# EAGLE design UWBFlat_v01 (EAGLE 9.6.1)

## Sheet 1 of 4
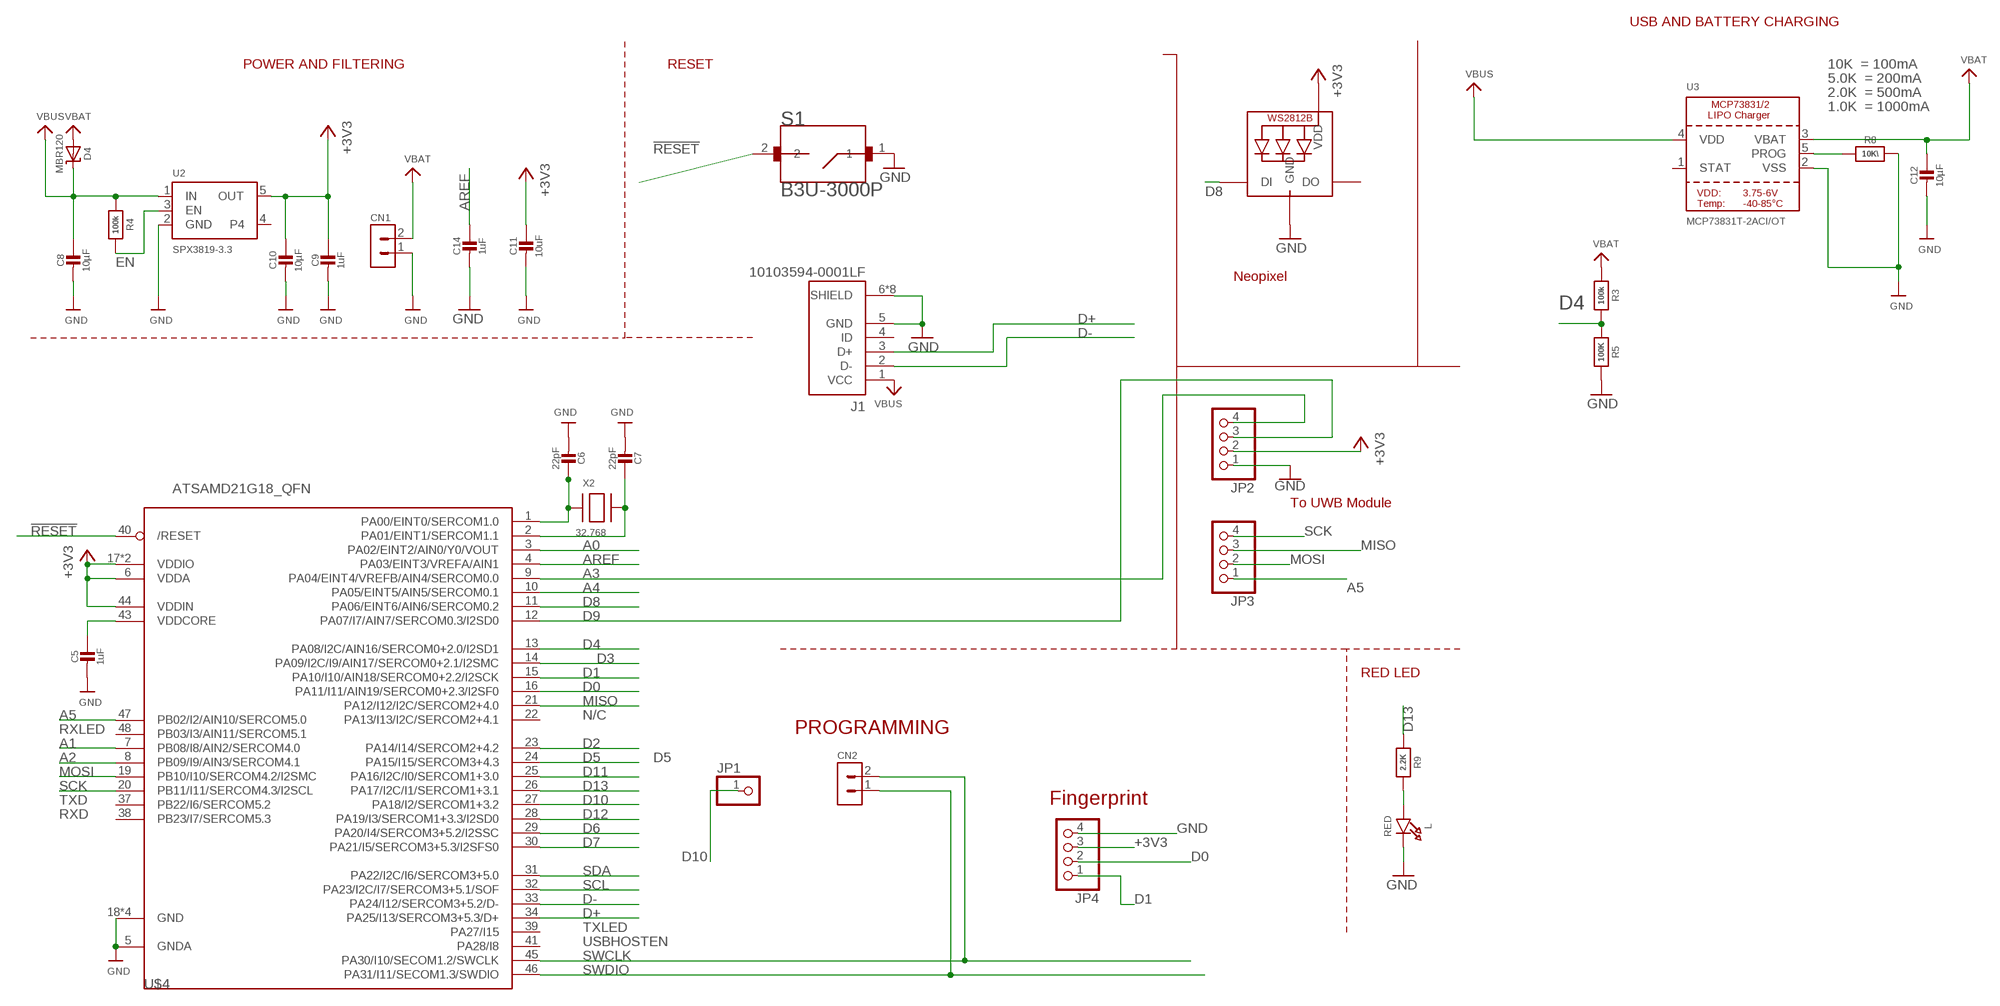
[diagram p0: schematic, sheet 1]

### Parts
C5  1uF  CAP_CERAMIC0603_NO  [0603-NO]
C6  22pF  CAP_CERAMIC0603_NO  [0603-NO]
C7  22pF  CAP_CERAMIC0603_NO  [0603-NO]
C8  10µF  CAP_CERAMIC0805-NOOUTLINE  [0805-NO]
C9  1uF  CAP_CERAMIC0603_NO  [0603-NO]
C10  10µF  CAP_CERAMIC0805-NOOUTLINE  [0805-NO]
C11  10uF  CAP_CERAMIC0805-NOOUTLINE  [0805-NO]
C12  10µF  CAP_CERAMIC0805-NOOUTLINE  [0805-NO]
C14  1uF  CAP_CERAMIC0603_NO  [0603-NO]
CN1  HEADER_1X02  [HEADER_1X02]
CN2  HEADER_1X02  [HEADER_1X02]
D4  MBR120  DIODE-SCHOTTKYSOD-123  [SOD-123]
J1  10103594-0001LF  [AMPHENOL_10103594-0001LF]
JP1  PINHD-1X1CB  [1X01-CLEANBIG]
JP2  HEADER-1X4ROUND  [1X04_ROUND]
JP3  HEADER-1X4ROUND  [1X04_ROUND]
JP4  HEADER-1X4ROUND  [1X04_ROUND]
L  RED  LED0805_NOOUTLINE  [CHIPLED_0805_NOOUTLINE]
LED1  WS2812B3535  [LED3535]
R3  100k  RESISTOR_0603_NOOUT  [0603-NO]
R4  100k  RESISTOR_0603_NOOUT  [0603-NO]
R5  100K  RESISTOR_0603_NOOUT  [0603-NO]
R8  10K\  RESISTOR_0603_NOOUT  [0603-NO]
R9  2.2K  RESISTOR_0603_NOOUT  [0603-NO]
S1  B3U-3000P  [SW_B3U-3000P]
U2  SPX3819-3.3  VREG_SOT23-5  [SOT23-5]
U3  MCP73831T-2ACI/OT  MCP73831/2  [SOT23-5]
U$4  ATSAMD21G18_QFN  ATSAMD21J_QFN  [TQFN48_7MM]
X2  32.768  XTAL-3.2X1.5  [XTAL3215]

### Nets
!RESET: S1.2 U$4.40(/RESET)
+3V3: C9.1 C10.1 C11.1 JP2.2 JP4.3 LED1.2(VDD) U2.5(OUT) U$4.6(VDDA) U$4.17(VDDIO) U$4.36(VDDIO) U$4.44(VDDIN) ; also sheet 2,3,4
A0: U$4.3(PA02/EINT2/AIN0/Y0/VOUT)
A1: U$4.7(PB08/I8/AIN2/SERCOM4.0)
A2: U$4.8(PB09/I9/AIN3/SERCOM4.1)
A3: JP2.4 U$4.9(PA04/EINT4/VREFB/AIN4/SERCOM0.0) ; also sheet 4
A4: U$4.10(PA05/EINT5/AIN5/SERCOM0.1)
A5: JP3.1 U$4.47(PB02/I2/AIN10/SERCOM5.0) ; also sheet 4
AREF: C14.1 U$4.4(PA03/EINT3/VREFA/AIN1)
D0: JP4.2 U$4.16(PA11/I11/AIN19/SERCOM0+2.3/I2SF0)
D1: JP4.1 U$4.15(PA10/I10/AIN18/SERCOM0+2.2/I2SCK)
D2: U$4.23(PA14/I14/SERCOM2+4.2)
D3: U$4.14(PA09/I2C/I9/AIN17/SERCOM0+2.1/I2SMC)
D4: R3.2 R5.1 U$4.13(PA08/I2C/AIN16/SERCOM0+2.0/I2SD1)
D5: U$4.24(PA15/I15/SERCOM3+4.3)
D6: U$4.29(PA20/I4/SERCOM3+5.2/I2SSC)
D7: U$4.30(PA21/I5/SERCOM3+5.3/I2SFS0)
D8: LED1.1(DI) U$4.11(PA06/EINT6/AIN6/SERCOM0.2)
D9: JP2.3 U$4.12(PA07/I7/AIN7/SERCOM0.3/I2SD0) ; also sheet 4
D10: JP1.1 U$4.27(PA18/I2/SERCOM1+3.2) ; also sheet 3
D11: U$4.25(PA16/I2C/I0/SERCOM1+3.0)
D12: U$4.28(PA19/I3/SERCOM1+3.3/I2SD0)
D13: R9.1 U$4.26(PA17/I2C/I1/SERCOM1+3.1)
D+: J1.3(D+) U$4.34(PA25/I13/SERCOM3+5.3/D+)
D-: J1.2(D-) U$4.33(PA24/I12/SERCOM3+5.2/D-)
EN: R4.2 U2.3(EN)
GND: C5.2 C6.2 C7.2 C8.2 C9.2 C10.2 C11.2 C12.2 C14.2 CN1.1 J1.5(GND) J1.6(SHIELD) J1.7(SHIELD) J1.8(SHIELD) J1.9(SHIELD) J1.10(SHIELD) J1.11(SHIELD) J1.S1(SHIELD) J1.S2(SHIELD) JP2.1 JP4.4 L.C LED1.4(GND) R5.2 R8.2 S1.1 U2.2(GND) U3.2(VSS) U$4.5(GNDA) U$4.18(GND) U$4.35(GND) U$4.42(GND) U$4.THERMAL(GND) ; also sheet 2,3,4
MISO: JP3.3 U$4.21(PA12/I12/I2C/SERCOM2+4.0) ; also sheet 3,4
MOSI: JP3.2 U$4.19(PB10/I10/SERCOM4.2/I2SMC) ; also sheet 3,4
N$4: R8.1 U3.5(PROG)
N$33: C6.1 U$4.1(PA00/EINT0/SERCOM1.0) X2.P$1
N$34: C7.1 U$4.2(PA01/EINT1/SERCOM1.1) X2.P$2
N$42: L.A R9.2
SCK: JP3.4 U$4.20(PB11/I11/SERCOM4.3/I2SCL) ; also sheet 3,4
SCL: U$4.32(PA23/I2C/I7/SERCOM3+5.1/SOF) ; also sheet 2
SDA: U$4.31(PA22/I2C/I6/SERCOM3+5.0) ; also sheet 2
SWCLK: CN2.2 U$4.45(PA30/I10/SECOM1.2/SWCLK)
SWDIO: CN2.1 U$4.46(PA31/I11/SECOM1.3/SWDIO)
VBAT: C12.1 CN1.2 D4.A R3.1 U3.3(VBAT)
VBUS: C8.1 D4.C J1.1(VCC) R4.1 U2.1(IN) U3.4(VDD)
VDDCORE1: C5.1 U$4.43(VDDCORE)
Unconnected: J1.4(ID) LED1.3(DO) U2.4 U3.1(STAT) U$4.22(PA13/I13/I2C/SERCOM2+4.1) U$4.37(PB22/I6/SERCOM5.2) U$4.38(PB23/I7/SERCOM5.3) U$4.39(PA27/I15) U$4.41(PA28/I8) U$4.48(PB03/I3/AIN11/SERCOM5.1)

### Notes on the sheet
- USB AND BATTERY CHARGING
- POWER AND FILTERING | RESET | 10K  = 100mA
- 5.0K  = 200mA
- 2.0K  = 500mA
- 1.0K  = 1000mA
- Neopixel
- To UWB Module
- RED LED
- N/C
- RXLED | PROGRAMMING
- TXD | Fingerprint
- RXD
- TXLED
- USBHOSTEN

## Sheet 2 of 4
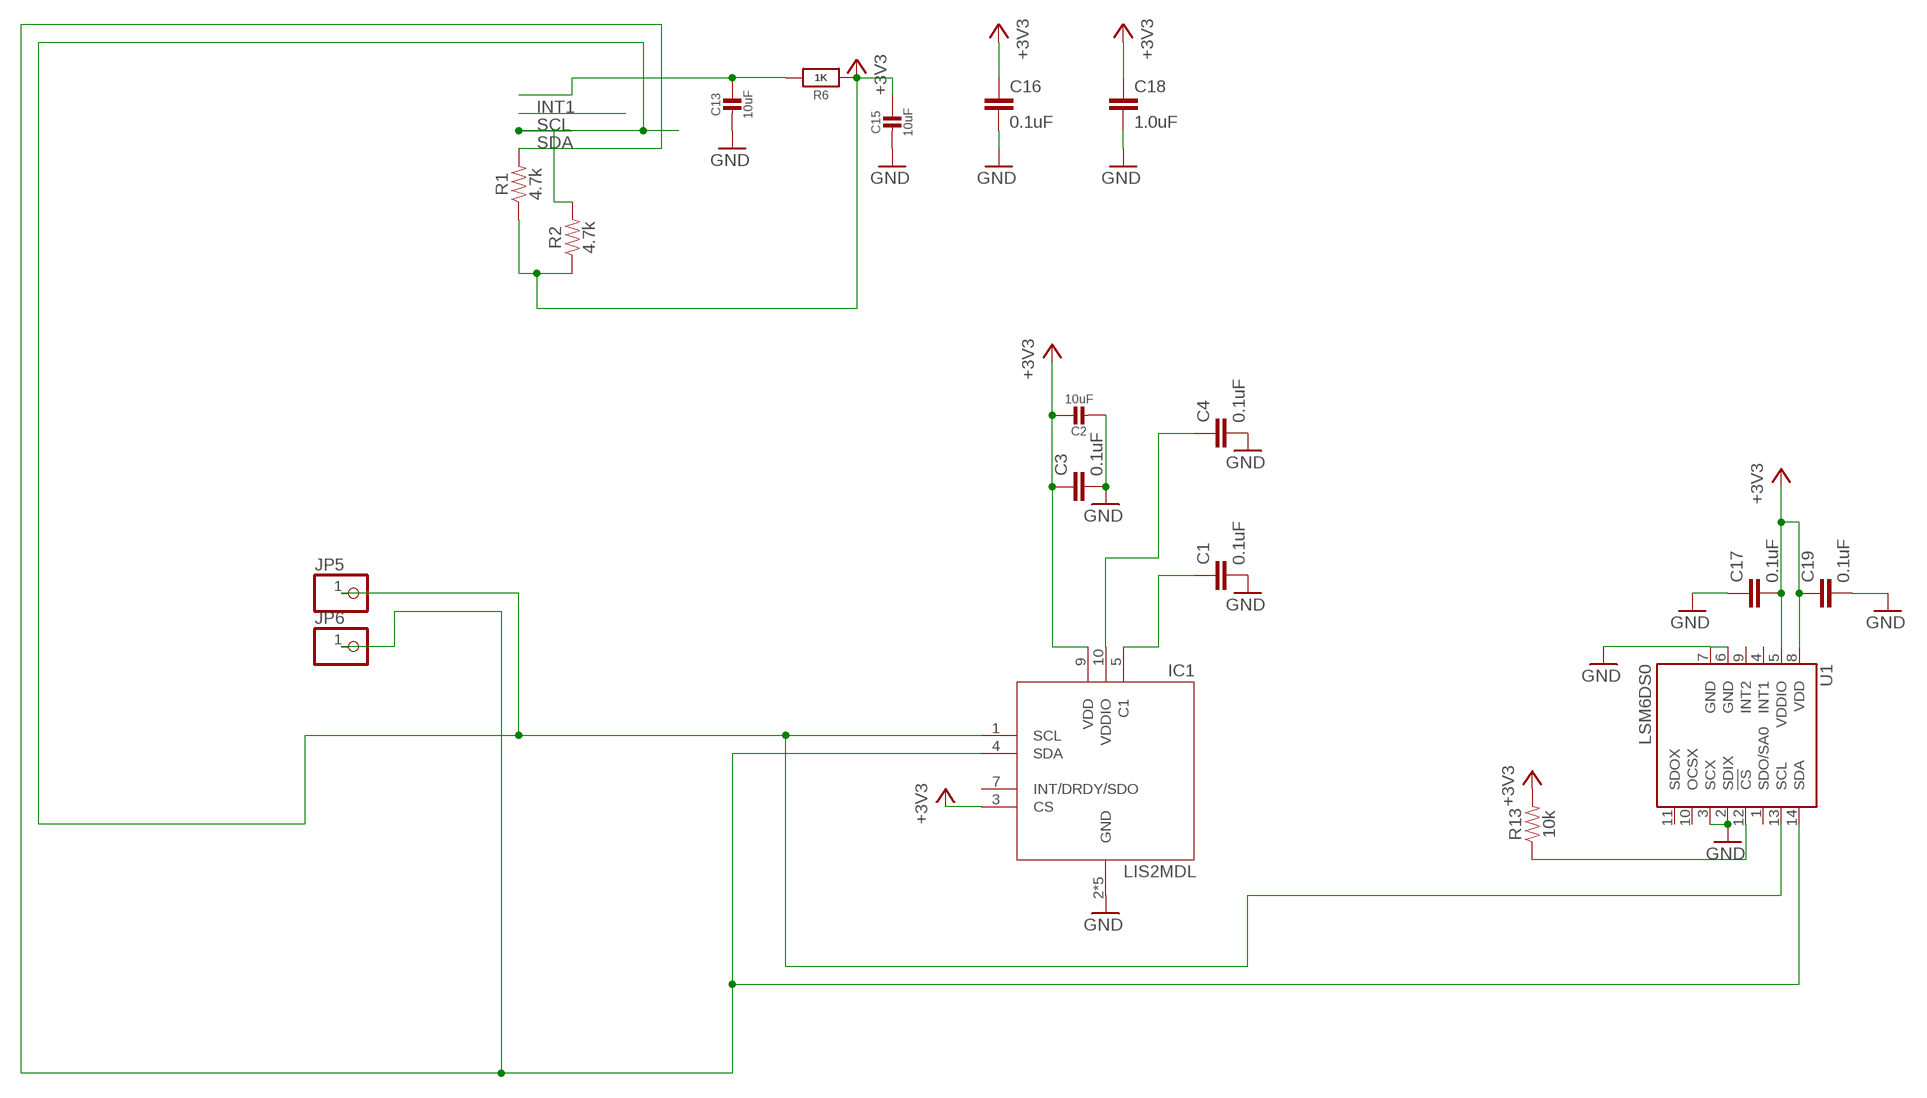
[diagram p1: schematic, sheet 2]

### Parts
C1  0.1uF  0.1UF-0402-16V-10%  [0402]
C2  10uF  CAP_CERAMIC0805-NOOUTLINE  [0805-NO]
C3  0.1uF  0.1UF-0402-16V-10%  [0402]
C4  0.1uF  0.1UF-0402-16V-10%  [0402]
C13  10uF  CAP_CERAMIC0805-NOOUTLINE  [0805-NO]
C15  10uF  CAP_CERAMIC0805-NOOUTLINE  [0805-NO]
C16  0.1uF  0.1UF-0402-16V-10%  [0402]
C17  0.1uF  0.1UF-0402-16V-10%  [0402]
C18  1.0uF  1.0UF-0603-16V-10%  [0603]
C19  0.1uF  0.1UF-0402-16V-10%  [0402]
IC1  LIS2MDL  [LGA12_2X2MM]
JP5  PINHD-1X1CB  [1X01-CLEANBIG]
JP6  PINHD-1X1CB  [1X01-CLEANBIG]
R1  4.7k  4.7KOHM-0603-1/10W-1%  [0603]
R2  4.7k  4.7KOHM-0603-1/10W-1%  [0603]
R6  1K  RESISTOR_0603_NOOUT  [0603-NO]
R13  10k  10KOHM-0603-1/10W-1%  [0603]
U1  LSM6DS0  [LGA14L]

### Nets
+3V3: C2.1 C3.1 C15.1 C16.1 C17.2 C18.1 C19.1 IC1.3(CS) IC1.9(VDD) R1.1 R2.1 R6.1 R13.2 U1.5(VDDIO) U1.8(VDD) ; also sheet 1,3,4
GND: C1.2 C2.2 C3.2 C4.2 C13.2 C15.2 C16.2 C17.1 C18.2 C19.2 IC1.2(GND) IC1.6(GND) IC1.8(GND) IC1.11(GND) IC1.12(GND) U1.2(SDIX) U1.3(SCX) U1.6(GND) U1.7(GND) ; also sheet 1,3,4
N$3: C13.1 R6.2
N$10: C1.1 IC1.5(C1)
N$15: C4.1 IC1.10(VDDIO)
N$19: R13.1 U1.12(!CS!)
SCL: IC1.1(SCL) JP5.1 R2.2 U1.13(SCL) ; also sheet 1
SDA: IC1.4(SDA) JP6.1 R1.2 U1.14(SDA) ; also sheet 1
Unconnected: IC1.7(INT/DRDY/SDO) U1.1(SDO/SA0) U1.4(INT1) U1.9(INT2) U1.10(OCSX) U1.11(SDOX)

## Sheet 3 of 4
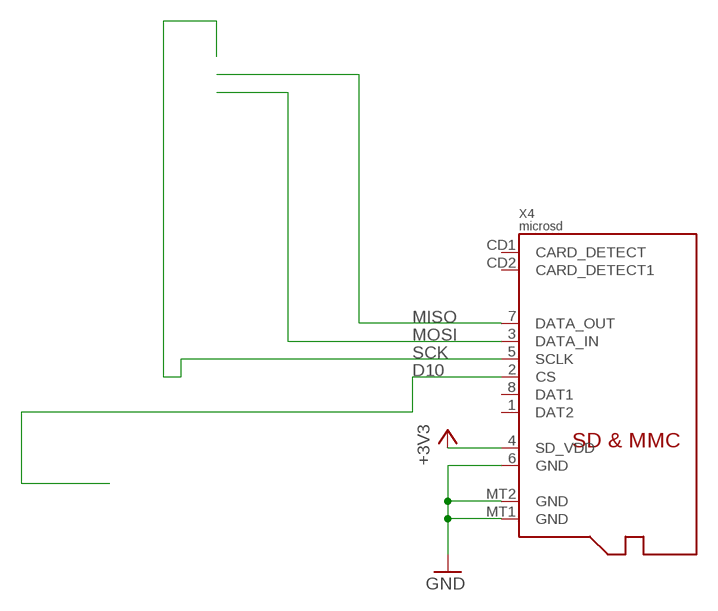
[diagram p2: schematic, sheet 3]

### Parts
X4  microsd  MICROSD  [MICROSD]

### Nets
+3V3: X4.4(SD_VDD) ; also sheet 1,2,4
D10: X4.2(CS) ; also sheet 1
GND: X4.6(GND) X4.MT1(GND) X4.MT2(GND) ; also sheet 1,2,4
MISO: X4.7(DATA_OUT) ; also sheet 1,4
MOSI: X4.3(DATA_IN) ; also sheet 1,4
SCK: X4.5(SCLK) ; also sheet 1,4
Unconnected: X4.1(DAT2) X4.8(DAT1) X4.CD1(CARD_DETECT) X4.CD2(CARD_DETECT1)

## Sheet 4 of 4
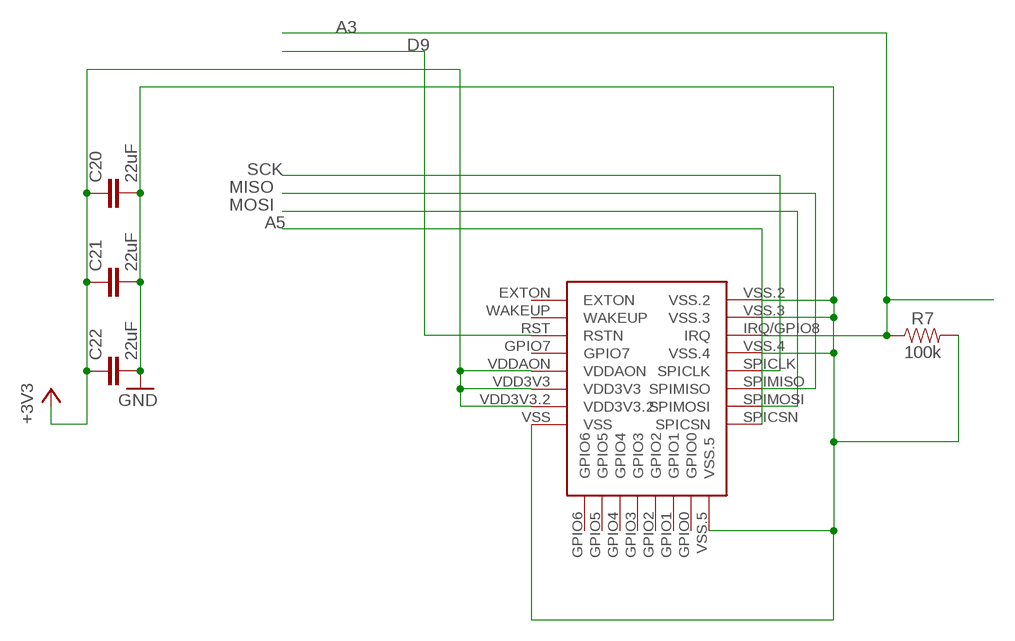
[diagram p3: schematic, sheet 4]

### Parts
C20  22uF  22UF-0805-6.3V-20%  [0805]
C21  22uF  22UF-0805-6.3V-20%  [0805]
C22  22uF  22UF-0805-6.3V-20%  [0805]
R7  100k  100KOHM-0603-1/10W-1%  [0603]
U$1  DWM1000  [DWM1000]

### Nets
+3V3: C20.1 C21.1 C22.1 U$1.VDD3V3 U$1.VDD3V3.2 U$1.VDDAON ; also sheet 1,2,3
A3: R7.1 U$1.IRQ/GPIO8(IRQ) ; also sheet 1
A5: U$1.SPICSN ; also sheet 1
D9: U$1.RST(RSTN) ; also sheet 1
GND: C20.2 C21.2 C22.2 R7.2 U$1.VSS U$1.VSS.2 U$1.VSS.3 U$1.VSS.4 U$1.VSS.5 ; also sheet 1,2,3
MISO: U$1.SPIMISO ; also sheet 1,3
MOSI: U$1.SPIMOSI ; also sheet 1,3
SCK: U$1.SPICLK ; also sheet 1,3
Unconnected: U$1.EXTON U$1.GPIO0 U$1.GPIO1 U$1.GPIO2 U$1.GPIO3 U$1.GPIO4 U$1.GPIO5 U$1.GPIO6 U$1.GPIO7 U$1.WAKEUP

## Library data of the parts
C1 C3 C4 C16 C17 C19 = SparkFun-Capacitors:0.1UF: 0.1µF ceramic capacitors A capacitor is a passive two-terminal electrical component used to store electrical energy temporarily in an electric field.; PROD_ID: CAP-12416
C2 C5-C15 = microbuilder:CAP_CERAMIC: Ceramic Capacitors For new designs, use the packages preceded by an '_' character since they are more reliable: The following footprints should be used on most boards: _0402 - Standard footprint for regular board layouts _0603 - Standard footprint for regular board layouts _0805 - Standard footprint for regular board layouts _1206 - Standard footprint for regular board layouts For extremely tight-pitch boards where space is at a premium, the following 'micro-pitch' footprints can be used (smaller pads, no silkscreen outline, etc.): _0402MP - Micro-pitch footprint for very dense/compact boards _0603MP - Micro-pitch footprint for very dense/compact boards _0805MP - Micro-pitch footprint for very dense/compact boards _1206MP - Micro-pitch footprint for very dense/compact boards
C18 = SparkFun-Capacitors:1.0UF: 1µF ceramic capacitors A capacitor is a passive two-terminal electrical component used to store electrical energy temporarily in an electric field.; PROD_ID: CAP-00868
C20-C22 = SparkFun-Capacitors:22UF: 22µF ceramic capacitors A capacitor is a passive two-terminal electrical component used to store electrical energy temporarily in an electric field.; PROD_ID: CAP-08402
CN1 CN2 = microbuilder:HEADER_1X02: 2-Pin 0,254cm / 0.1" Header
D4 = microbuilder:DIODE-SCHOTTKY
IC1 = adafruit_sensor:LIS2MDL
J1 = 10103594-0001LF:10103594-0001LF: USB - micro B USB 2.0 Receptacle Connector 5 Position Surface Mount, Right Angle; Through Hole Check availability <https://pricing.snapeda.com/parts/10103594-0001LF/Amphenol%20ICC/view-part?ref=eda>; AVAILABILITY: In Stock; DESCRIPTION: Micro USB 2.0, Input Output Connectors, B TYPE RECEPTACLE; MF: Amphenol ICC; MP: 10103594-0001LF; PACKAGE: None; PRICE: None; PURCHASE-URL: https://pricing.snapeda.com/search/part/10103594-0001LF/?ref=eda
JP1 JP5 JP6 = adafruit_ashutosh_modified:PINHD-1X1: Pin header 1x1 for 0.1" spacing With round pins
JP2-JP4 = microbuilder:HEADER-1X4: PIN HEADER
L = microbuilder:LED: LED 0603 - 0603 Surface Mount Package 2mA: Green LED - Low Power (3.9mcd, 2ma, 1.7Vf) - Digikey: 475-2709-2-ND Orange LED - Low Power (9.8mcd, 2ma, 1.8Vf) - Digikey: 475-1194-2-ND Red LED - Low Power (5mcd, 2ma, 1.8Vf) - Digikey: 475-1195-2-ND Yellow LED - Low Power (7mcd, 2ma, 1.8Vf) - Digikey: 475-1196-2-ND 5mA: Blue LED - Low Power (17mcd, 5ma, 2.9Vf) - Digikey: LNJ937W8CRACT-ND 0805 - 0805 Surface Mount Package 2mA: Red LED (8.8mcd, 2mA, 1.8Vf, Clear) - Low Power [Digikey: 475-2510-1-ND] Green LED (5mcd, 2mA, 1.8Vf, Clear) - Low Power [Digikey: 475-2730-1-ND] Yellow LED (11.3mcd, 2mA, 1.8Vf, Clear) - Low Power [Digikey: 475-2555-1-ND] 20mA: Red LED (104mcd, 20mA, Diffused) - LS R976 [Digikey: 475-1278-6-ND] Red LED (12mcd, 20mA, 2.0Vf, Clear) - APT2012EC [Digikey: 754-1128-1-ND] Green LED (15mcd, 20mA, 2.2Vf, Clear) - APT2012GC [Digikey: 754-1131-1-ND] Orange LED (160mcd, 20mA, 2.1Vf, Clear) - APT2012SECK [Digikey: 754-1130-1-ND] 1206 - 1206 Surface Mount Package Green LED (26mcd, 20mA, Diffused) - LG N971 [Digikey: 475-1407-6-ND] Red LED (15mcd, 20mA, Diffused) - LH N974 [Digikey: 475-1416-6-ND] Cree - Cree High-Power Surface Mount LEDs XPEBWT-L1-0000-00D50 - White 111lm 350mA 2.9Vf 6200K 110° XTEAWT-00-0000-00000LEE3 - White 114lm 350mA 2.85Vf 5000K 115° Everlight - Everlight 45-21 Series Surface Mount LEDs 45-21/QK2C-B2832AC2CB2/2T - Warm White 2000mcd 20mA 3.25Vf 3050K 120° 45-21/LK2C-B38452C4CB2/2T - Nuetral White 2000mcd 20mA 3.25Vf 4150K 120° 45-21/LK2C-B50634C6CB2/2T - Cold White 2200mcd 20mA 3.25Vf 5650K 120° PLCC2 Reverse Mount LS T77K-J1L2-1-0-2-R18-Z - Red 11.25mcd 2mA 1.8Vf 630nm 120° LO T77K-L1M2-24-Z - Orange 19.6mcd 2mA 1.8Vf 606nm 120° LY T77K-K2M1-26-Z - Yellow 15.7mcd 2mA 1.8Vf 587nm 120°
LED1 = adafruit:WS2812B
R1 R2 = SparkFun-Resistors:4.7KOHM: 4.7kΩ resistor A resistor is a passive two-terminal electrical component that implements electrical resistance as a circuit element. Resistors act to reduce current flow, and, at the same time, act to lower voltage levels within circuits. - Wikipedia; PROD_ID: RES-07857
R3-R6 R8 R9 = microbuilder:RESISTOR: Resistors For new designs, use the packages preceded by an '_' character since they are more reliable: The following footprints should be used on most boards: _0402 - Standard footprint for regular board layouts _0603 - Standard footprint for regular board layouts _0805 - Standard footprint for regular board layouts _1206 - Standard footprint for regular board layouts For extremely tight-pitch boards where space is at a premium, the following 'micro-pitch' footprints can be used (smaller pads, no silkscreen outline, etc.): _0402MP - Micro-pitch footprint for very dense/compact boards _0603MP - Micro-pitch footprint for very dense/compact boards _0805MP - Micro-pitch footprint for very dense/compact boards _1206MP - Micro-pitch footprint for very dense/compact boards
R7 = SparkFun-Resistors:100KOHM: 100kΩ resistor A resistor is a passive two-terminal electrical component that implements electrical resistance as a circuit element. Resistors act to reduce current flow, and, at the same time, act to lower voltage levels within circuits. - Wikipedia; PROD_ID: RES-07828
R13 = SparkFun-Resistors:10KOHM: 10kΩ resistor A resistor is a passive two-terminal electrical component that implements electrical resistance as a circuit element. Resistors act to reduce current flow, and, at the same time, act to lower voltage levels within circuits. - Wikipedia; PROD_ID: RES-00824
S1 = B3U-3000P:B3U-3000P: Switch Tactile N.O. SPST Button Gull Wing 0.05A 12VDC 1.59N SMD Embossed T/R Check availability <https://pricing.snapeda.com/parts/B3U-3000P/Omron/view-part?ref=eda>; AVAILABILITY: In Stock; DESCRIPTION: Tactile Switch SPST-NO Side Actuated Surface Mount, Right Angle; MF: Omron; MP: B3U-3000P; PACKAGE: Custom Package Omron; PRICE: None; PURCHASE-URL: https://pricing.snapeda.com/search/part/B3U-3000P/?ref=eda
U1 = temp:LSM6DS0; PROD_ID: IC-15837
U2 = microbuilder:VREG_SOT23-5: SOT23-5 Fixed Voltage Regulators Part Current Out V Out V In V Dropout θJA (°C/W) TJ (°C) Digikey Part No. ADP121 150mA 3.3V 3.4-5.5V 0.09V @ 150mA -- -- ADP121-AUJZ33R7CT-ND ADP121 150mA 3.0V 3.1-5.5V 0.09V @ 150mA -- -- ADP121-AUJZ30R7CT-ND ADP122 300mA 3.3V 3.4-5.5V 0.085V @ 300mA -- -- ADP122AUJZ-3.3-R7CT-ND ADP1712 300mA 3.3V 3.5-5.5V 0.17V @ 300mA -- -- ADP1712AUJZ-3.3-R7TR-ND AP7311 (Low Cost) 150mA 3.3V 3.5-6V 0.15V @ 150mA -- -- AP7311-33WG-7DICT-ND LD39015M18R 150mA 1.8V 1.9V-5.5V 0.08V @ 100mA -- -- 497-6977-1-ND LP2985A-33DBVR 150mA 3.3V 3.3-16V 0.28V @ 150mA 206 150 296-18479-1-ND MCP1824T-3302E/OT 300mA 3.3V 3.5V-6V 0.2V @ 300mA -- -- MCP1824T-3302E/OTCT-ND MIC5205-2.5YM5 TR 150mA 2.5V 2.7-16V 0.165V @ 150mA -- -- 576-1257-2-ND MIC5205-3.0YM5 TR 150mA 3.0V 3.2V-16V 0.165V @ 150mA -- -- 576-1258-2-ND MIC5205-3.3YM5 TR 150mA 3.3V 3.5V-16V 0.165V @ 150mA -- -- 576-1259-2-ND TPS780330220 150mA 3.3V+2.2V 3.6-5.5V 250mV Max -- -- 296-23332-1-ND TDA3663/N1,135 100mA 3.3V 3.5-45V 0.18V @ 50mA -- -- 568-5343-1-ND Max operating temp can be calculated using θJA, TJ (max junction temperature), and power in watts. Set the "Maximum Ambient Temperature" until it reaches TJ ("Max Junction Temperature"), which is the absolute limit for safe use of the regulator: Heat Sink Temperature Calculator <http://www.daycounter.com/Calculators/Heat-Sink-Temperature-Calculator.phtml> For example, With 12V source into a 3.3V LP2985 and a 30mA load, we are dissipating (12V-3.3V) * 0.03A = 0.261W. With a θJA of 206 °C/W, a TJ of 150°C, and 261mW we can safely use the chip without a heat sink up to 75°C (=147.1°C Junction Temperature).
U3 = microbuilder:MCP73831/2: MCP73831/2 LIPO Charger VDD: 3.75 - 6V Temp -40 - 85°C Programmable Charge Rate: 15-500mA NOTE: STAT is a tri-state logic output on the MCP73831 and an open-drain output on the MCP73832. SOT23-5 with 4.2V output and tri-state logic on STAT = MCP73831T-2ACI/OT
U$1 = DWM1000:DWM1000
U$4 = microbuilder:ATSAMD21J
X2 = adafruit2:XTAL: Low cost SMT crystals, no capacitors included http://www.ladyada.net/library/eagle
X4 = microbuilder:MICROSD: MicroSD/Transflash Card Holder with SPI pinout 3M: 2908-05WB-MG 4UConnector: 19656 Footprint courtesy: Adafruit Industries

## Module MYAD8232
Ports: 

### Library data of the parts

## Board
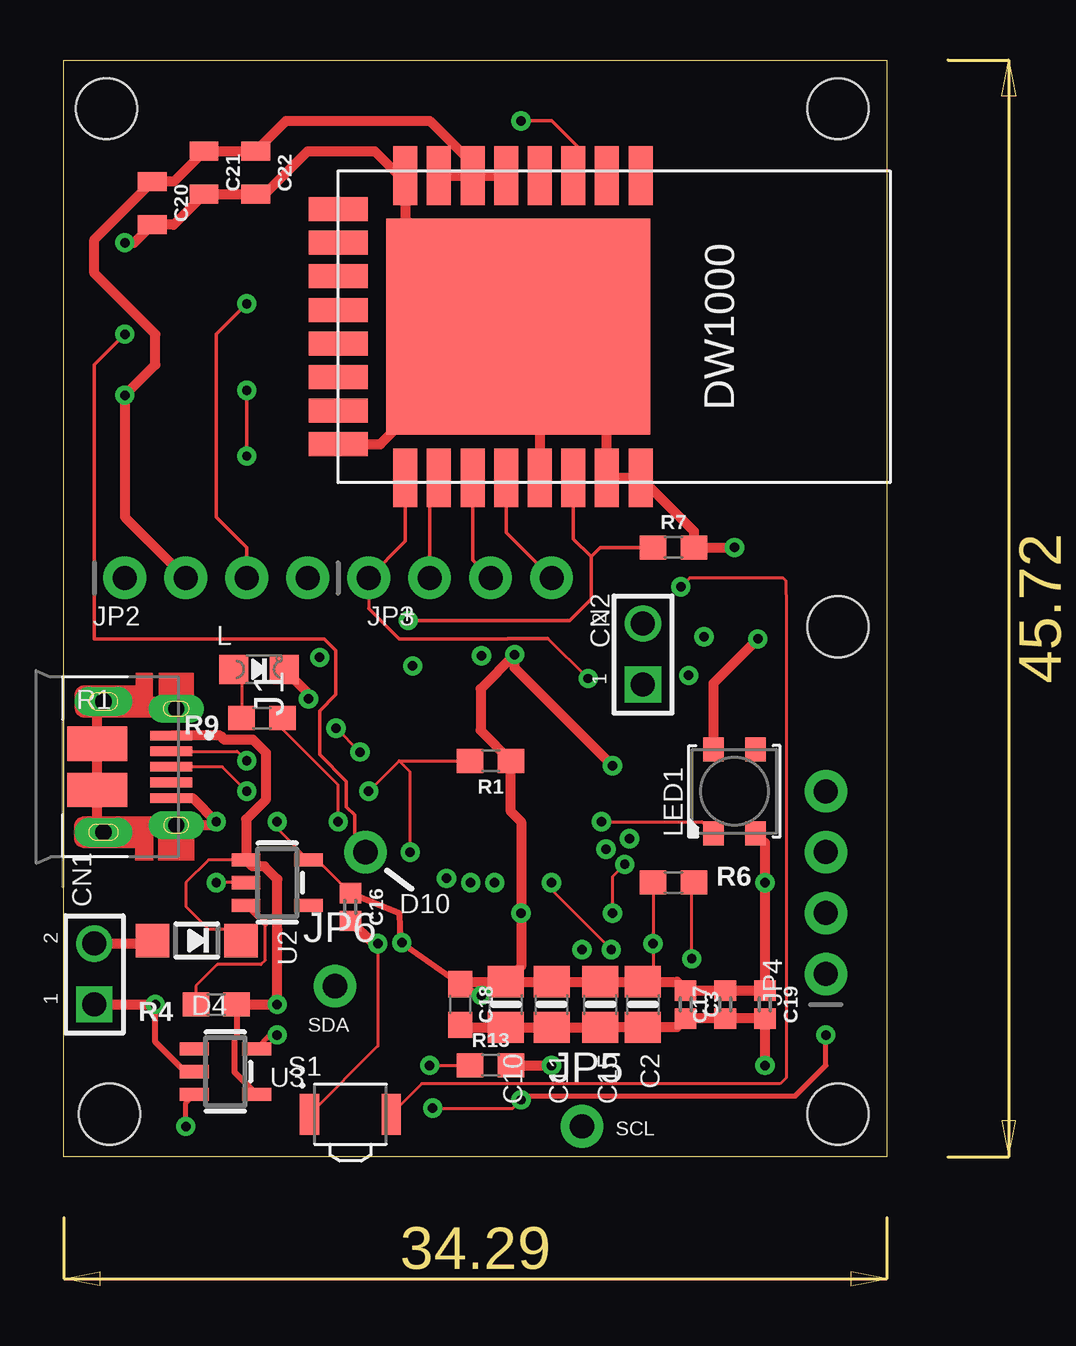
[diagram p4: board, top side]
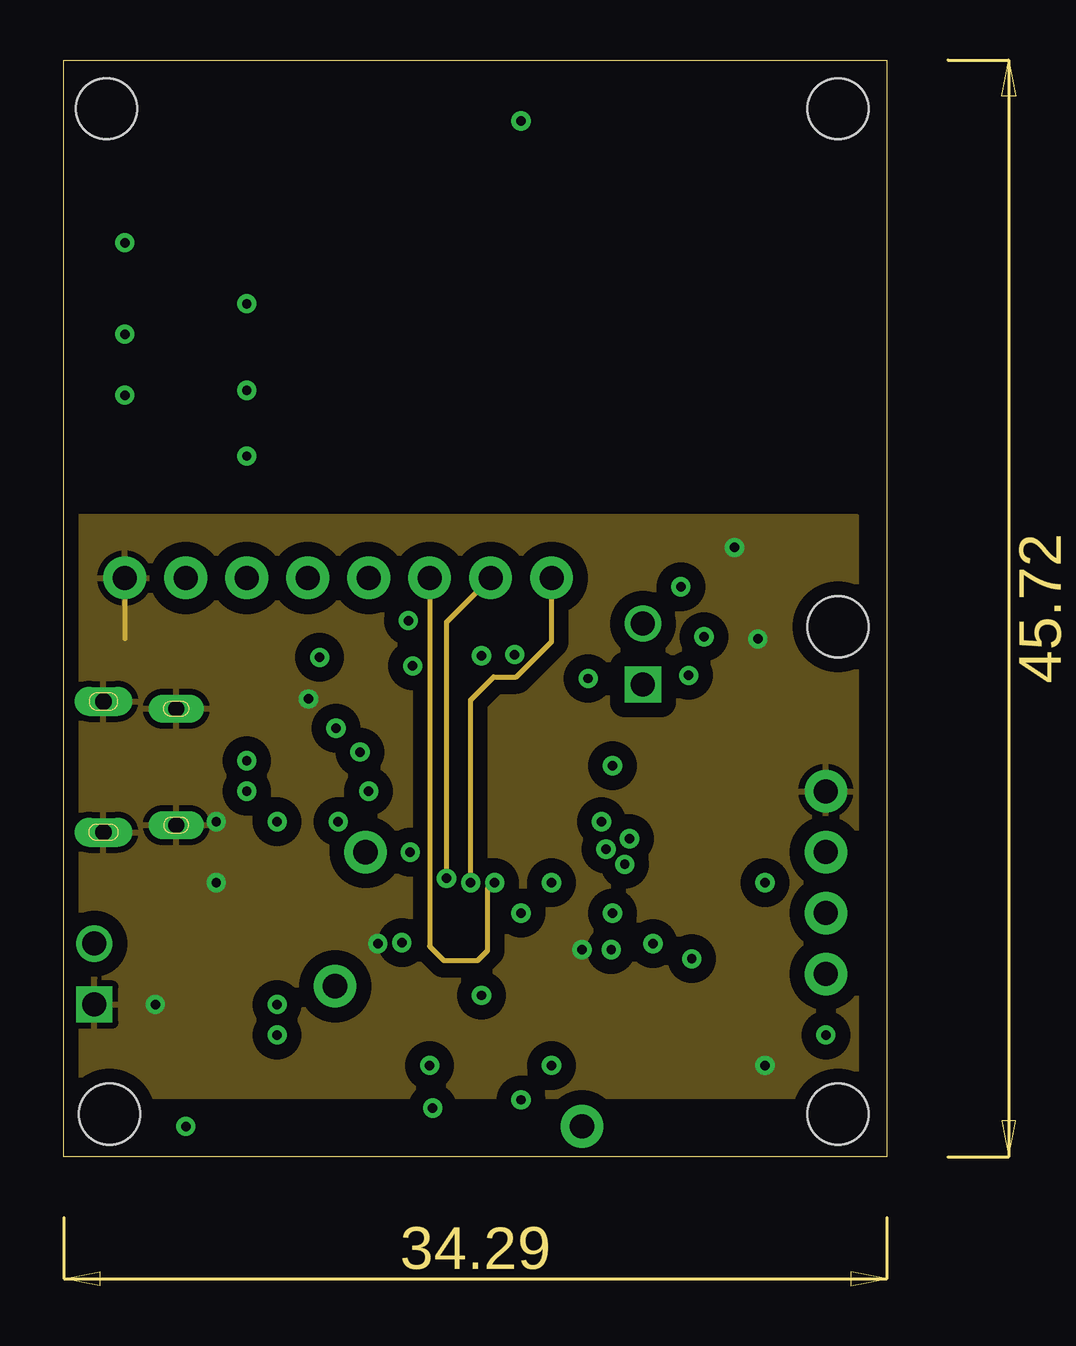
[diagram p5: board, inner layer Route2]
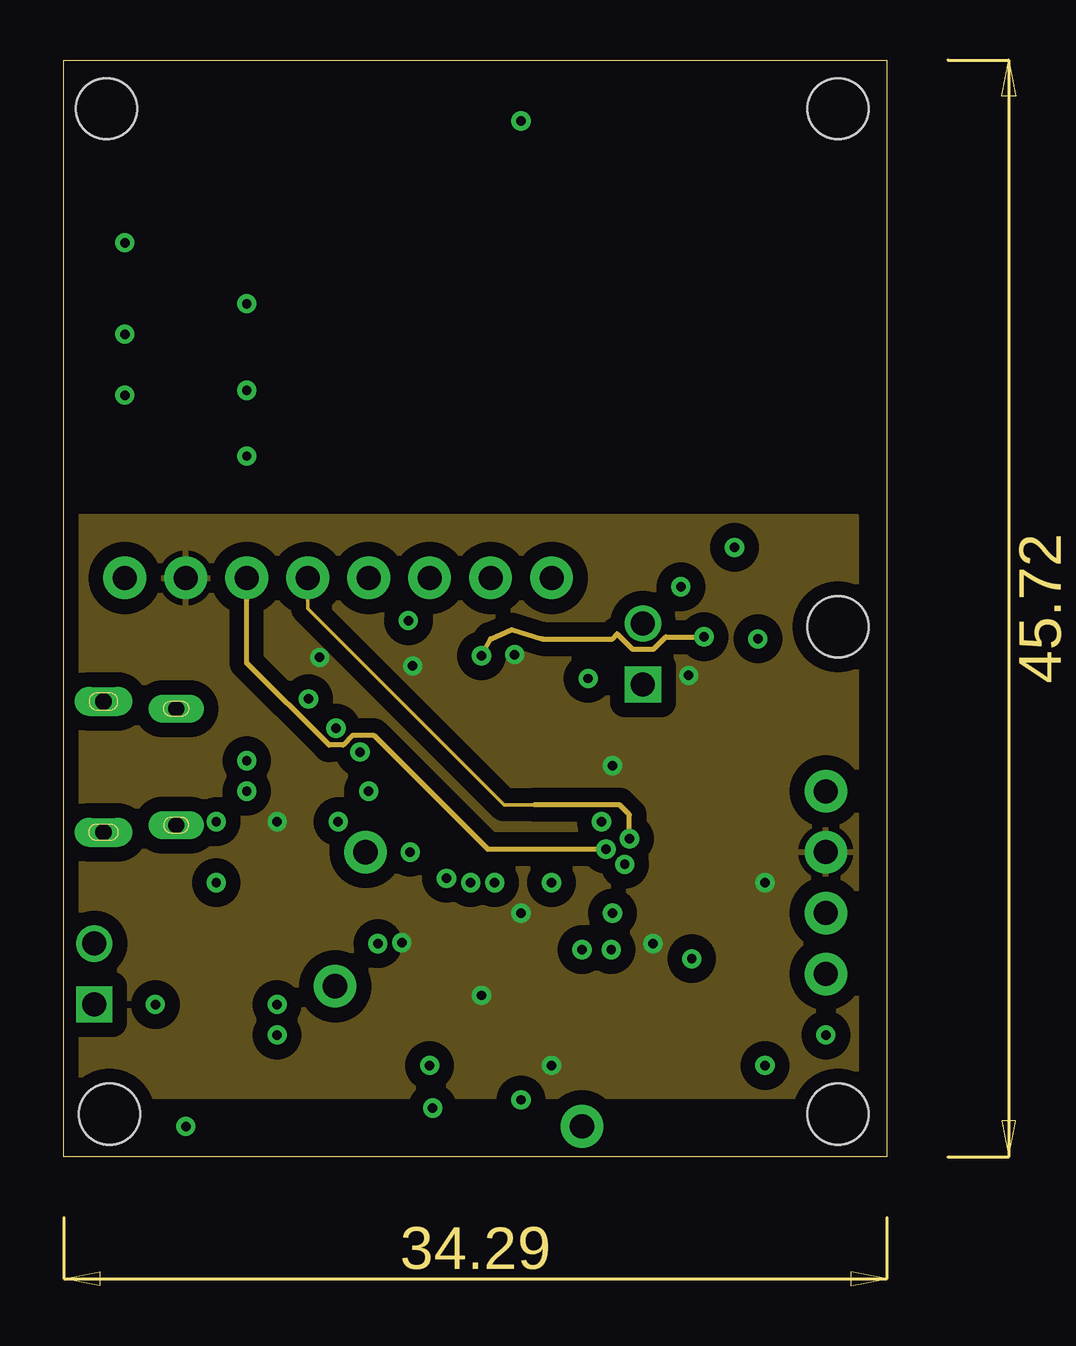
[diagram p6: board, inner layer Route15]
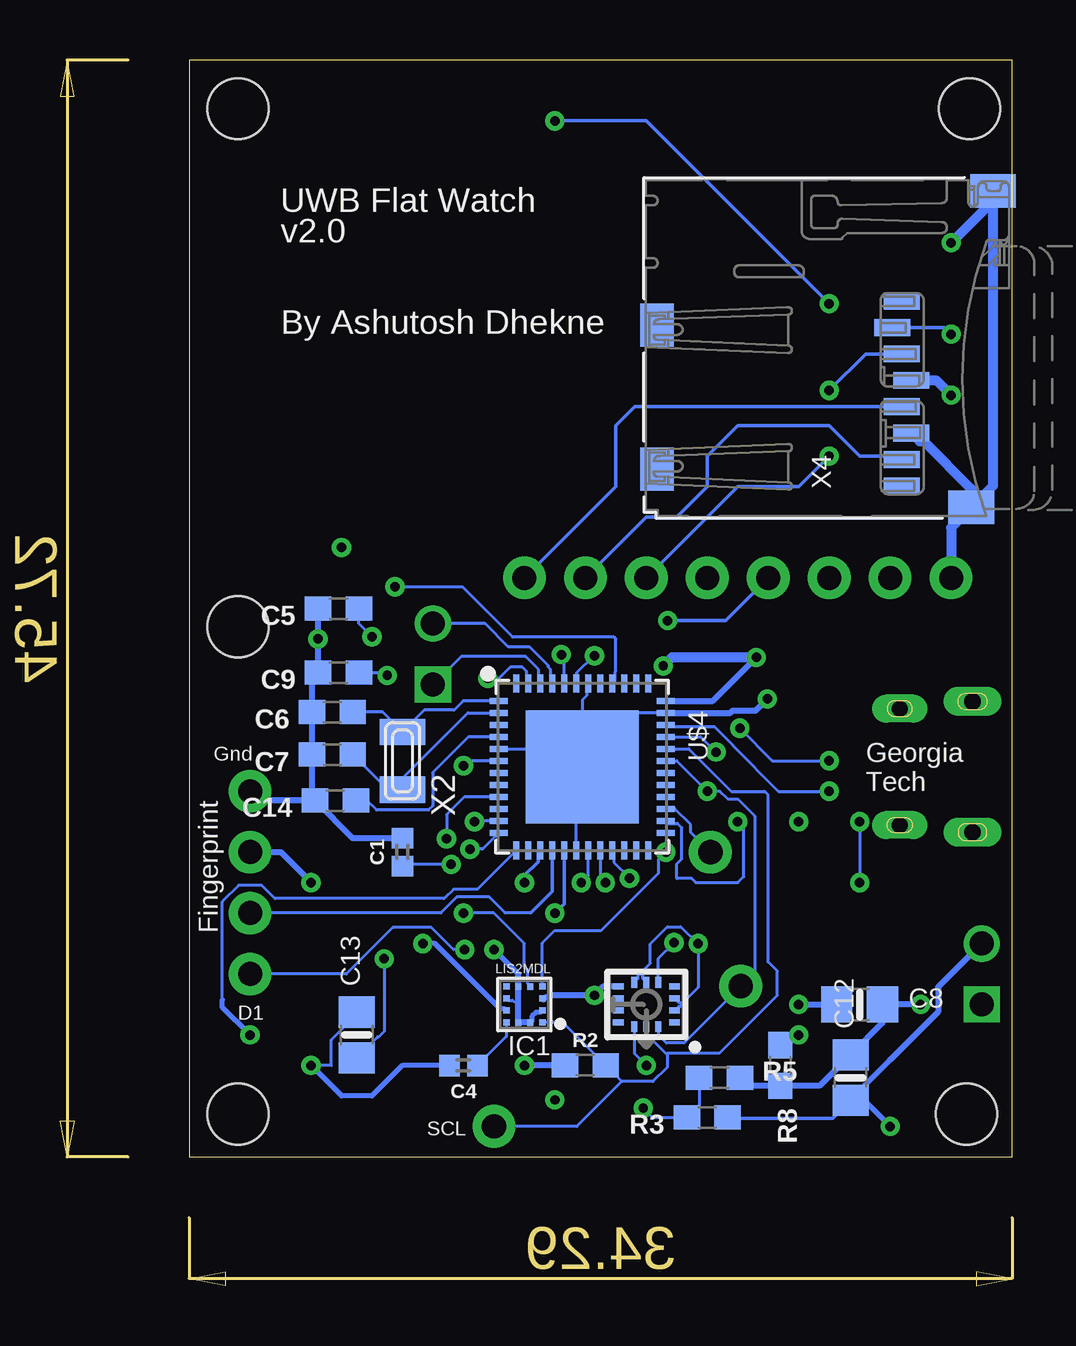
[diagram p7: board, bottom side, seen from below]

Size 34.29 x 45.72 mm. Coordinates in mm from the lower left corner, seen from the top.
Outline: 0,0 0,45.72 34.29,45.72 34.29,0 0,0
Copper layers (1+2*15+16): Top 0.035mm / dielectric 0.2mm / Route2 0.035mm / dielectric 0.5mm / Route15 0.035mm / dielectric 0.2mm / Bottom 0.035mm
Design rules "adafruit *": minimum track width 5mil, minimum drill 15.5mil, track to track 8mil, track to pad 8mil, pad to pad 8mil, via to via 8mil, smd to smd 8mil, copper to edge 10mil, drill to drill 8mil, minimum pad ring 10mil, minimum via ring 8mil, stop-mask expansion 2mil, vias tented up to drill 20mil, thermal gap 10mil
Holes 2.54 mm at 1.91,1.78 32.26,22.1 32.26,1.78 1.78,43.69 32.26,43.69

### Footprints (pad centres in the part's own frame; a part is rotated, then mirrored left to right if it is on the bottom)
0402 = smd 0.85 x 0.9: 1 -0.58,0; 2 0.58,0
0805-NO = smd 1.3 x 1.5: 1 -0.95,0; 2 0.95,0
0603-NO = smd 1.1 x 1: 1 -0.85,0; 2 0.85,0
0603 = smd 1.1 x 1: 1 -0.85,0; 2 0.85,0
0805 = smd 0.8 x 1.2: 1 -0.9,0; 2 0.9,0
HEADER_1X02 = drill 1 square: 1 0,0 | drill 1: 2 2.54,0
SOD-123 = smd 1.4 x 1.4: A 1.85,0; C -1.85,0
LGA12_2X2MM = smd 0.275 x 0.25: 1 -0.75,0.75; 2 -0.75,0.25; 3 -0.75,-0.25; 4 -0.75,-0.75; 7 0.75,-0.75; 8 0.75,-0.25; 9 0.75,0.25; 10 0.75,0.75 | smd 0.25 x 0.275: 5 -0.25,-0.75; 6 0.25,-0.75; 11 0.25,0.75; 12 -0.25,0.75
AMPHENOL_10103594-0001LF = smd 0.4 x 1.75: 1 -1.3,2.825; 2 -0.65,2.825; 3 0,2.825; 4 0.65,2.825; 5 1.3,2.825 | drill 0.65 pad 0.73 long: 6 -2.425,3.03; 7 2.425,3.03 | drill 0.7 pad 1.2 long: 8 -2.725,0; 9 2.725,0 | smd 1.05 x 2.1 bottom: 10 -2.425,3.03; 11 2.425,3.03 | smd 1.425 x 2.5: S1 -0.963,-0.25; S2 0.963,-0.25
1X01-CLEANBIG = drill 1.016 pad 1.778: 1 0,0
1X04_ROUND = drill 1 pad 1.778: 1 -3.81,0; 2 -1.27,0; 3 1.27,0; 4 3.81,0
CHIPLED_0805_NOOUTLINE = smd 1.2 x 1.2: A 0,-1.05; C 0,1.05
LED3535 = smd 1 x 0.85: 1 -1.75,0.875; 2 -1.75,-0.875; 3 1.75,-0.875; 4 1.75,0.875
SW_B3U-3000P = smd 0.8 x 1.7: 1 -1.7,0; 2 1.7,0
LGA14L = smd 0.45 x 0.25: 1 -1.175,0.75; 2 -1.175,0.25; 3 -1.175,-0.25; 4 -1.175,-0.75; 8 1.175,-0.75; 9 1.175,-0.25; 10 1.175,0.25; 11 1.175,0.75 | smd 0.25 x 0.45: 5 -0.5,-0.925; 6 0,-0.925; 7 0.5,-0.925; 12 0.5,0.925; 13 0,0.925; 14 -0.5,0.925
SOT23-5 = smd 0.55 x 1.2: 1 -0.95,-1.3; 2 0,-1.3; 3 0.95,-1.3; 4 0.95,1.3; 5 -0.95,1.3
DWM1000 = smd 2.45 x 1: EXTON -2.8,12.6; GPIO7 -2.8,8.4; IRQ/GPIO8 9.8,9.8; RST -2.8,9.8; SPICLK 9.8,7; SPICSN 9.8,2.8; SPIMISO 9.8,5.6; SPIMOSI 9.8,4.2; VDD3V3 -2.8,4.2; VDD3V3.2 -2.8,5.6; VDDAON -2.8,7; VSS -2.8,2.8; VSS.2 9.8,12.6; VSS.3 9.8,11.2; VSS.4 9.8,8.4; WAKEUP -2.8,11.2 | smd 9 x 11: GND 3.5,7.5 | smd 1 x 2.45: GPIO0 7,0; GPIO1 5.6,0; GPIO2 4.2,0; GPIO3 2.8,0; GPIO4 1.4,0; GPIO5 0,0; GPIO6 -1.4,0; VSS.5 8.4,0
TQFN48_7MM = smd 0.25 x 0.75: 1 -2.75,-3.475; 2 -2.25,-3.475; 3 -1.75,-3.475; 4 -1.25,-3.475; 5 -0.75,-3.475; 6 -0.25,-3.475; 7 0.25,-3.475; 8 0.75,-3.475; 9 1.25,-3.475; 10 1.75,-3.475; 11 2.25,-3.475; 12 2.75,-3.475; 25 2.75,3.475; 26 2.25,3.475; 27 1.75,3.475; 28 1.25,3.475; 29 0.75,3.475; 30 0.25,3.475; 31 -0.25,3.475; 32 -0.75,3.475; 33 -1.25,3.475; 34 -1.75,3.475; 35 -2.25,3.475; 36 -2.75,3.475 | smd 0.75 x 0.25: 13 3.475,-2.75; 14 3.475,-2.25; 15 3.475,-1.75; 16 3.475,-1.25; 17 3.475,-0.75; 18 3.475,-0.25; 19 3.475,0.25; 20 3.475,0.75; 21 3.475,1.25; 22 3.475,1.75; 23 3.475,2.25; 24 3.475,2.75; 37 -3.475,2.75; 38 -3.475,2.25; 39 -3.475,1.75; 40 -3.475,1.25; 41 -3.475,0.75; 42 -3.475,0.25; 43 -3.475,-0.25; 44 -3.475,-0.75; 45 -3.475,-1.25; 46 -3.475,-1.75; 47 -3.475,-2.25; 48 -3.475,-2.75 | smd 4.7 x 4.7: THERMAL 0,0
XTAL3215 = smd 1.1 x 1.9: P$1 1.2,0; P$2 -1.2,0
MICROSD = smd 0.7 x 1.5: 1 9,-10.64; 2 7.9,-10.24; 3 6.8,-10.64; 4 5.7,-11.04; 5 4.6,-10.64; 6 3.5,-11.04; 7 2.4,-10.64; 8 1.3,-10.64 | smd 1.8 x 1.4: CD1 2,-0.44; CD2 8,-0.44 | smd 1.4 x 1.9: MT1 0.4,-13.54; MT2 13.6,-14.44

### Placement (x,y rotation side)
C1  25.4,12.7 90 bottom
C2  24.13,6.35 270 top
C3  25.91,6.35 270 top
C4  22.86,3.81 180 bottom
C5  28.07,22.86 180 bottom
C6  28.32,18.54 180 bottom
C7  28.32,16.76 180 bottom
C8  6.35,6.35 0 bottom
C9  28.07,20.19 180 bottom
C10  18.41,6.35 270 top
C11  20.32,6.35 270 top
C12  6.73,3.3 90 bottom
C13  27.3,5.08 90 bottom
C14  28.19,14.86 180 bottom
C15  22.35,6.35 270 top
C16  11.94,10.41 270 top
C17  27.56,6.35 90 top
C18  16.51,6.35 270 top
C19  29.21,6.35 270 top
C20  3.68,39.75 270 top
C21  5.84,41.02 270 top
C22  8,41.02 270 top
CN1  1.27,6.35 90 top
CN2  24.13,19.68 90 top
D4  5.54,9.02 180 top
IC1  20.32,6.35 180 bottom
J1  1.65,16.26 270 top
JP1  12.57,12.7 0 top
JP2  6.35,24.13 0 top
JP3  16.51,24.13 0 top
JP4  31.75,11.43 90 top
JP5  21.59,1.27 0 top
JP6  11.3,7.11 0 top
L  8.13,20.32 270 top
LED1  27.94,15.24 90 top
R1  17.78,16.51 180 top
R2  17.78,3.81 0 bottom
R3  12.7,1.65 180 bottom
R4  6.35,6.35 180 top
R5  12.19,3.3 0 bottom
R6  25.4,11.43 0 top
R7  25.4,25.4 0 top
R8  9.65,3.81 270 bottom
R9  8.26,18.29 180 top
R13  17.78,3.81 0 top
S1  11.94,1.78 0 top
U1  15.24,6.35 180 bottom
U2  8.89,11.43 270 top
U3  6.73,3.56 270 top
U$1  11.43,38.1 270 top
U$4  17.91,16.26 270 bottom
X2  25.4,16.51 90 bottom
X4  15.24,26.67 90 bottom

### Tracks (layer width: path | path; a pad name or v marks a point on that pad's centre or on a via)
!RESET  (via drill 0.39)
  Top 0.127: S1.2 14.9,3.04 29.84,3.04 30.11,3.31 30.11,22.86 30.1,24 29.97,24.13 26.08,24.13 v25.71,23.76
  Bottom 0.127: v25.71,23.76 22.91,23.76 20.81,21.67 16.59,21.67 16.51,21.59 16.51,20.25 16.55,20.22 16.55,19.84 U$4.40
+3V3  (via drill 0.39)
  Top 0.127: C16.1 10.55,12.38 U2.5 8.89,13.68 v8.89,13.97 | C11.1 C15.1 22.86,7.3 C2.1 24.55,7.72 v24.55,8.89 R6.1 | 18.59,20.74 v18.78,20.93 | v14.08,8.93 14.01,8.93
  Top 0.254: C16.1 13.97,10.16 14.01,8.93 | v14.08,8.93 C18.1 | v17.4,6.73 17.18,6.73 16.61,7.3
  Top 0.406: C18.1 16.61,7.3 C10.1 | C10.1 C11.1 22.86,7.3 | C15.1 C2.1 25.54,7.3 C3.1 C17.2 C19.1 v29.21,11.43 29.21,13.09 LED1.2 | R2.1 v20.32,3.81 | v22.86,16.3 18.78,20.38 v18.78,20.93 17.36,19.51 17.36,17.78 R1.1 18.63,14.39 19.05,13.97 v19.05,10.16 19.05,7.94 C10.1 | JP2.2 2.54,26.67 v2.54,31.75 3.81,33.02 3.81,34.29 1.27,36.83 1.27,38.24 C20.1 4.57,40.65 C21.1 C22.1 9.26,43.18 15.24,43.18 17.03,41.39 U$1.VDD3V3.2 | U$1.VDD3V3 U$1.VDD3V3.2 | U$1.VDD3V3.2 U$1.VDDAON
  Bottom 0.127: U$4.6 22.66,16.51 v22.86,16.3 | C9.1 26.29,20.19 26.16,20.07 v26.04,20.07 | U$4.44 18.66,20.81 v18.78,20.93 | U1.5 14.74,8.27 v14.08,8.93
  Bottom 0.152: U$4.17 18.66,10.55 v19.05,10.16
  Bottom 0.203: IC1.9 21.13,6.16 21.32,6.16 24.05,8.89 v24.55,8.89
  Bottom 0.254: U$4.36 12.47,19.01 v10.66,20.82 | U1.8 17.03,7.1 v17.4,6.73 19.21,6.73 19.3,6.64 19.45,6.64 19.53,6.56 IC1.3 | R2.1 v20.32,3.81 | JP4.3 30.48,12.7 v29.21,11.43
  Bottom 0.406: v10.66,20.82 14.18,20.82 v14.54,20.46 | X4.4 3.16,32.37 v2.54,31.75
  pour Route15 (isolate 0.61): 0,26.67 0,2.54 33.02,2.54 33.02,26.67
A3  (via drill 0.39)
  Top 0.152: U$1.IRQ/GPIO8 21.23,25.76 21.97,25.02 | 21.97,25.02 21.97,23.24 21.08,22.35 v14.35,22.35 | R7.1 22.35,25.4 21.97,25.02
  Route15 0.152: 19.61,14.67 18.34,14.67 10.16,22.86 JP2.4
  Route15 0.203: v23.57,13.26 23.57,14.26 23.15,14.67 19.61,14.67
  Bottom 0.127: v23.57,13.26 23.57,14.26 22.82,15.01 U$4.9
  Bottom 0.152: v14.35,22.35 11.94,22.35 JP2.4
A5  (via drill 0.39)
  Top 0.127: JP3.1 12.7,22.86 | v21.84,19.94 20.17,21.61
  Top 0.152: U$1.SPICSN 14.23,25.66 JP3.1 | 12.7,22.86 13.97,21.59 18.48,21.59 18.5,21.61 20.17,21.61
  Bottom 0.127: U$4.47 20.23,19.8 20.23,20.23 20.41,20.41 20.91,20.41 21.38,19.94 v21.84,19.94
AREF
  Bottom 0.127: U$4.4 22.65,17.51 24.14,16.01 24.14,14.63 24.32,14.46 26.48,14.46 26.88,14.86 C14.1
D0
  Bottom 0.127: 20.05,10.16 21.12,10.16 21.79,10.83 23.14,10.83 23.8,10.16 JP4.2
  Bottom 0.152: U$4.16 19.16,11.06 20.05,10.16
D1  (via drill 0.39)
  Top 0.127: v22.81,8.64 20.32,11.13 v20.32,11.43
  Bottom 0.127: v22.81,8.64 23.28,8.64 24.2,9.56 25.8,9.56 27.74,7.62 JP4.1
  Bottom 0.152: U$4.15 19.75,12.68 19.75,12.29 20.32,11.72 v20.32,11.43
D4  (via drill 0.39)
  Top 0.127: v15.37,2.03 18.7,2.03 v19.05,2.38
  Top 0.203: v19.05,2.38 19.21,2.54 30.48,2.54 31.75,3.81 v31.75,5.08
  Bottom 0.127: U$4.13 22.28,11.16 23.27,11.16 23.67,10.76 30.72,10.76 31.27,11.32 32.23,11.32 32.91,10.64 32.91,6.56 | R5.1 13.04,2.16 R3.2 14.99,1.65 v15.37,2.03
  Bottom 0.203: v31.75,5.08 32.91,6.24 32.91,6.56
D8  (via drill 0.39)
  Top 0.127: LED1.1 26.59,13.97 v22.4,13.97
  Bottom 0.127: U$4.11 22.36,14.01 v22.4,13.97
D9  (via drill 0.39)
  Top 0.152: JP2.3 7.62,25.4 6.35,26.67 6.35,34.29 v7.62,35.56 | v19.05,43.18 20.32,43.18 21.59,41.91 21.59,41.26 U$1.RST
  Route15 0.203: v22.59,12.82 17.66,12.82 12.9,17.58 12.05,17.58 11.63,17.16 11.05,17.16 7.62,20.59 JP2.3
  Bottom 0.127: U$4.12 22.06,12.82 v22.59,12.82
  Bottom 0.152: v7.62,35.56 15.24,43.18 v19.05,43.18
D10  (via drill 0.39)
  Top 0.152: JP1.1 12.11,13.16 12.11,14.25 11.77,14.59 11.77,15.65 10.66,16.77 10.66,18.59 11.34,19.27 11.34,21.1 10.85,21.59 1.27,21.59 1.27,33.02 v2.54,34.29
  Bottom 0.127: JP1.1 13.4,13.53 13.4,13.85 14.05,14.51 U$4.27
  Bottom 0.152: v2.54,34.29 2.82,34.57 X4.2
D13  (via drill 0.39)
  Top 0.127: R9.1 9.11,17.84 11.43,15.51 v11.43,13.97
  Bottom 0.127: U$4.26 14.32,13.9 13.95,13.9 13.76,13.71 13.76,12.42 13.97,12.22 13.97,11.6 13.36,11.6 13.19,11.43 11.43,11.43 11.18,11.68 11.18,13.72 v11.43,13.97
D+  (via drill 0.39)
  Top 0.127: J1.3 6.6,16.26 v7.62,15.24
  Bottom 0.127: v7.62,15.24 9.73,15.24 11.63,17.14 11.63,17.16 12.4,17.94 14.36,17.94 U$4.34
D-  (via drill 0.39)
  Top 0.127: v12.34,16.87 v11.34,17.87 | J1.2 7.22,16.91 v7.62,16.51
  Bottom 0.127: U$4.33 12.97,17.51 v12.34,16.87 | v11.34,17.87 9.98,16.51 v7.62,16.51
EN
  Top 0.127: R4.2 5.5,7.12 6.39,8.01 8.21,8.01 8.39,8.19 8.39,9.68
  Top 0.203: 8.39,9.68 8.39,9.84 8.21,10.02 8.05,10.02 U2.3
GND  (via drill 0.39)
  Top 0.127: v13.08,8.89 13.08,4.62 S1.1 | U2.2 v6.35,11.43
  Top 0.152: C11.2 20.32,5.08
  Top 0.254: v3.81,6.35 3.81,4.79 5.04,3.56 U3.2
  Top 0.406: v13.08,8.89 12.88,8.89 C16.2 | v29.21,3.81 C19.2 C17.1 C3.2 25.54,5.4 C2.2 C15.2 C11.2 C10.2 16.61,5.4 C18.2 | CN1.1 v3.81,6.35 | L.C 10.2,19.3 v10.2,19.09 | v28.92,21.59 27.07,19.74 LED1.4 | J1.5 5.36,14.96 v6.35,13.97 6.21,13.83 J1.7 1.95,13.83 J1.9 1.4,13.78 J1.S2 J1.S1 1.4,18.73 J1.8 4.38,18.98 J1.6 | U$1.VSS 14.23,40.64 | 14.23,40.64 14.23,39.11 19.83,33.51 | 19.83,33.51 19.83,33.02 | 19.83,33.02 U$1.VSS.4 | 19.83,33.51 22.63,30.71 U$1.VSS.3 U$1.VSS.2 26.25,26.08 R7.2 v27.94,25.4 | 14.23,40.64 12.96,41.91 10.16,41.91 8.37,40.12 C22.2 C21.2 4.57,38.85 C20.2 2.93,38.1 v2.54,38.1 | U$1.VSS.5 13.19,29.7 16.51,33.02 19.83,33.02
  Route2 0.203: JP2.1 2.54,21.59
  Bottom 0.127: 20.57,6.35 IC1.6 20.57,7.62 | IC1.11 20.57,6.35 | U$4.5 19.55,17.01 18.8,16.26 U$4.THERMAL | U$4.42 17.73,19.66 17.73,19.23 17.91,19.05 17.91,16.51 | 17.91,16.51 U$4.THERMAL | IC1.8 21,6.53 20.81,6.53 20.63,6.35 20.57,6.35 | U$4.18 18.16,16.01 U$4.THERMAL | U$4.35 15.91,18.51 17.91,16.51 | C13.2 27.3,5.93 28.36,4.88 28.36,3.81 v29.21,3.81 | 15.53,7.61 15.45,7.61 15.38,7.54 15.38,7.42 U1.6 | 15.53,7.61 15.6,7.54 15.6,7.42 U1.7 | v6.35,13.97 v6.35,11.43 | 13.77,6.38 13.77,6.32 13.81,6.28 13.88,6.28 U1.2 | 13.77,6.38 13.81,6.42 13.88,6.42 U1.3 | 15.53,7.61 15.07,8.07 15.07,8.88 14.36,9.59 13.81,9.59 13.11,8.89 v13.08,8.89 13.08,7.07 13.77,6.38
  Bottom 0.203: 20.57,7.62 v21.59,8.64 | IC1.2 19.64,6.03 19.83,6.03 20.01,5.85 20.01,5.66 20.04,5.63 | C4.2 25.4,3.81 26.67,2.54 27.94,2.54 v29.21,3.81
  Bottom 0.254: U$4.35 11.74,18.51 11.64,18.6 10.69,18.6 v10.2,19.09 | 20.04,5.63 IC1.12 IC1.11 20.57,7.62 | C14.2 31.37,14.86 JP4.4 | C1.2 27.46,13.28 C14.2 | C14.2 29.17,14.99 C7.2 C6.2 29.17,19.94 C9.2 v28.92,21.59 C5.2 | v3.81,6.35 C8.2 5.4,5.58 C12.2 8.02,2.96 R8.2 11,2.96 R5.2
  Bottom 0.406: X4.MT1 0.8,27.97 X4.MT2 0.8,39.84 v2.54,38.1 | X4.6 3.86,29.83 3.68,29.83 1.7,27.84 X4.MT1 | X4.MT1 2.54,26.23 JP2.1
  pour Route2 (isolate 0.61): 0,26.67 0,2.54 33.02,2.54 33.02,26.67
MISO  (via drill 0.39)
  Top 0.152: U$1.SPIMISO 17.03,24.88 JP3.3
  Route2 0.203: v15.95,11.61 15.95,22.29 JP3.3
  Bottom 0.127: U$4.21 16.59,12.71 16.59,12.28 15.95,11.64 v15.95,11.61
  Bottom 0.152: JP3.3 15.24,26.67 13.97,26.67 12.7,27.94 12.7,29.21 11.43,30.48 7.62,30.48 6.35,29.21 4.74,29.21 X4.7
MOSI  (via drill 0.39)
  Top 0.152: v7.62,31.95 v7.62,29.21 | U$1.SPIMOSI 15.24,27.91 JP3.2
  Route2 0.203: v17.95,11.43 17.92,11.46 17.65,11.19 17.65,8.6 17.24,8.19 15.83,8.19 15.24,8.78 JP3.2
  Bottom 0.127: v17.95,11.43 17.66,11.72 U$4.19
  Bottom 0.152: X4.3 6.1,33.47 v7.62,31.95 | v7.62,29.21 8.89,27.94 11.43,27.94 JP3.2
N$3  (via drill 0.39)
  Top 0.127: v26.16,8.26 26.16,11.34 R6.2
  Bottom 0.127: C13.1 26.43,5 26.39,5 26.15,5.24 26.15,8.24 v26.16,8.26
N$4  (via drill 0.39)
  Top 0.203: U3.5 8.61,5.08 v8.89,5.08
  Bottom 0.203: v8.89,5.08 9.23,5.08 R8.1
N$10  (via drill 0.39)
  Top 0.127: v22.86,10.16 22.86,11.68 v23.37,12.19
  Bottom 0.127: v22.86,10.16 21.59,10.16 20.32,8.89 20.32,7.93 20.18,7.78 20.18,7.21 IC1.5 | v23.37,12.19 25.33,12.19 C1.1
N$15
  Bottom 0.127: C4.1 21.07,5.02 IC1.10
N$19  (via drill 0.39)
  Top 0.127: v15.24,3.81 R13.1
  Bottom 0.127: U1.12 15.74,4.31 v15.24,3.81
N$33
  Bottom 0.127: C6.1 26.23,18.54 X2.P$1 24.48,18.63 23.25,18.63 22.87,19.01 U$4.1
N$34
  Bottom 0.127: C7.1 26.02,15.31 X2.P$2 25.4,15.78 22.67,18.51 U$4.2
N$42
  Top 0.127: L.A 7.41,19.99 R9.2
SCK  (via drill 0.39)
  Top 0.152: U$1.SPICLK 18.43,26.02 JP3.4
  Route2 0.203: v16.95,11.43 16.95,19.05 17.9,20 18.85,20 20.32,21.47 JP3.4
  Bottom 0.127: U$4.20 17.16,11.64 v16.95,11.43
  Bottom 0.152: JP3.4 16.51,27.94 16.51,30.48 15.72,31.27 X4.5
SCL
  Bottom 0.127: U$4.32 13.47,17.01 11.7,15.24 10.31,15.24 10.16,15.09 10.16,8.12 9.78,7.74 9.78,6.73 12.19,4.32 14.37,4.32 14.37,4.25 | IC1.1 18.72,5.6 R2.2 16.26,3.14 | 16.26,3.14 14.96,3.14 14.37,3.74 14.37,4.25 | 16.26,3.14 18.14,1.27 JP5.1 | U1.13 15.24,5.12 14.37,4.25
SDA  (via drill 0.39)
  Top 0.127: v12.7,15.24 13.97,16.51 | 13.97,16.51 R1.2 | 13.97,16.51 14.43,16.05 v14.43,12.7
  Bottom 0.127: U$4.31 13.97,16.51 v12.7,15.24 12.17,15.24 11.84,14.91 11.43,14.91 10.72,14.21 10.72,7.69 JP6.1 13.66,4.75 14.4,4.75 14.73,5.09 U1.14 | IC1.4 19.57,8.91 19.05,9.43 17.13,9.43 14.73,11.83 14.73,12.4 v14.43,12.7
SWCLK
  Bottom 0.127: U$4.45 19.23,19.8 19.23,20.32 19.32,20.41 19.32,20.47 20.11,21.26 20.98,21.26 21.95,22.22 CN2.2
SWDIO
  Bottom 0.127: U$4.46 19.73,19.8 19.73,20.31 20.27,20.85 22.96,20.85 CN2.1
VBAT  (via drill 0.39)
  Top 0.127: 3.81,8.89 D4.A
  Top 0.203: v5.08,1.27 5.08,2.25 U3.3
  Top 0.406: CN1.2 3.81,8.89
  Bottom 0.152: C12.1 7.47,1.61 11.81,1.61 R3.1
  Bottom 0.203: 5.08,4.05 6.73,2.4 C12.1 6.16,2.35 v5.08,1.27
  Bottom 0.254: CN1.2 3.08,7.08 3.08,6.05 5.08,4.05
VBUS  (via drill 0.39)
  Top 0.127: D4.C 6.91,9.49 6.02,9.49 5.08,10.43 5.08,11.43 6.03,12.38 U2.1
  Top 0.254: R4.1 7.2,5.02 7.1,4.92 7.1,3.54 U3.4
  Top 0.406: R4.1 v8.89,6.35 8.89,9.46 8.9,9.47 8.9,11.57 8.36,12.11 7.86,12.11 U2.1 7.59,14.07 8.43,14.91 8.43,16.84 7.89,17.38 6.69,17.38 6.51,17.56 J1.1
  Bottom 0.127: 7.62,6.35 C8.1
  Bottom 0.254: v8.89,6.35 7.62,6.35
VDDCORE1  (via drill 0.39)
  Route15 0.203: v26.67,21.68 25.08,21.68 24.57,21.17 23.69,21.17 23.06,21.8 22.86,21.59 19.94,21.59 18.67,21.97 17.78,21.59 v17.4,20.88
  Bottom 0.127: U$4.43 18.13,19.75 18.13,20.18 17.43,20.88 v17.4,20.88 | v26.67,21.68 27.22,22.22 C5.1

### Text on the board
tPlace: + | R1 | D10 | SDA | SCL
bPlace: UWB Flat Watch | v2.0 | By Ashutosh Dhekne | Gnd | Georgia / Tech | Fingerprint | D1 | SCL